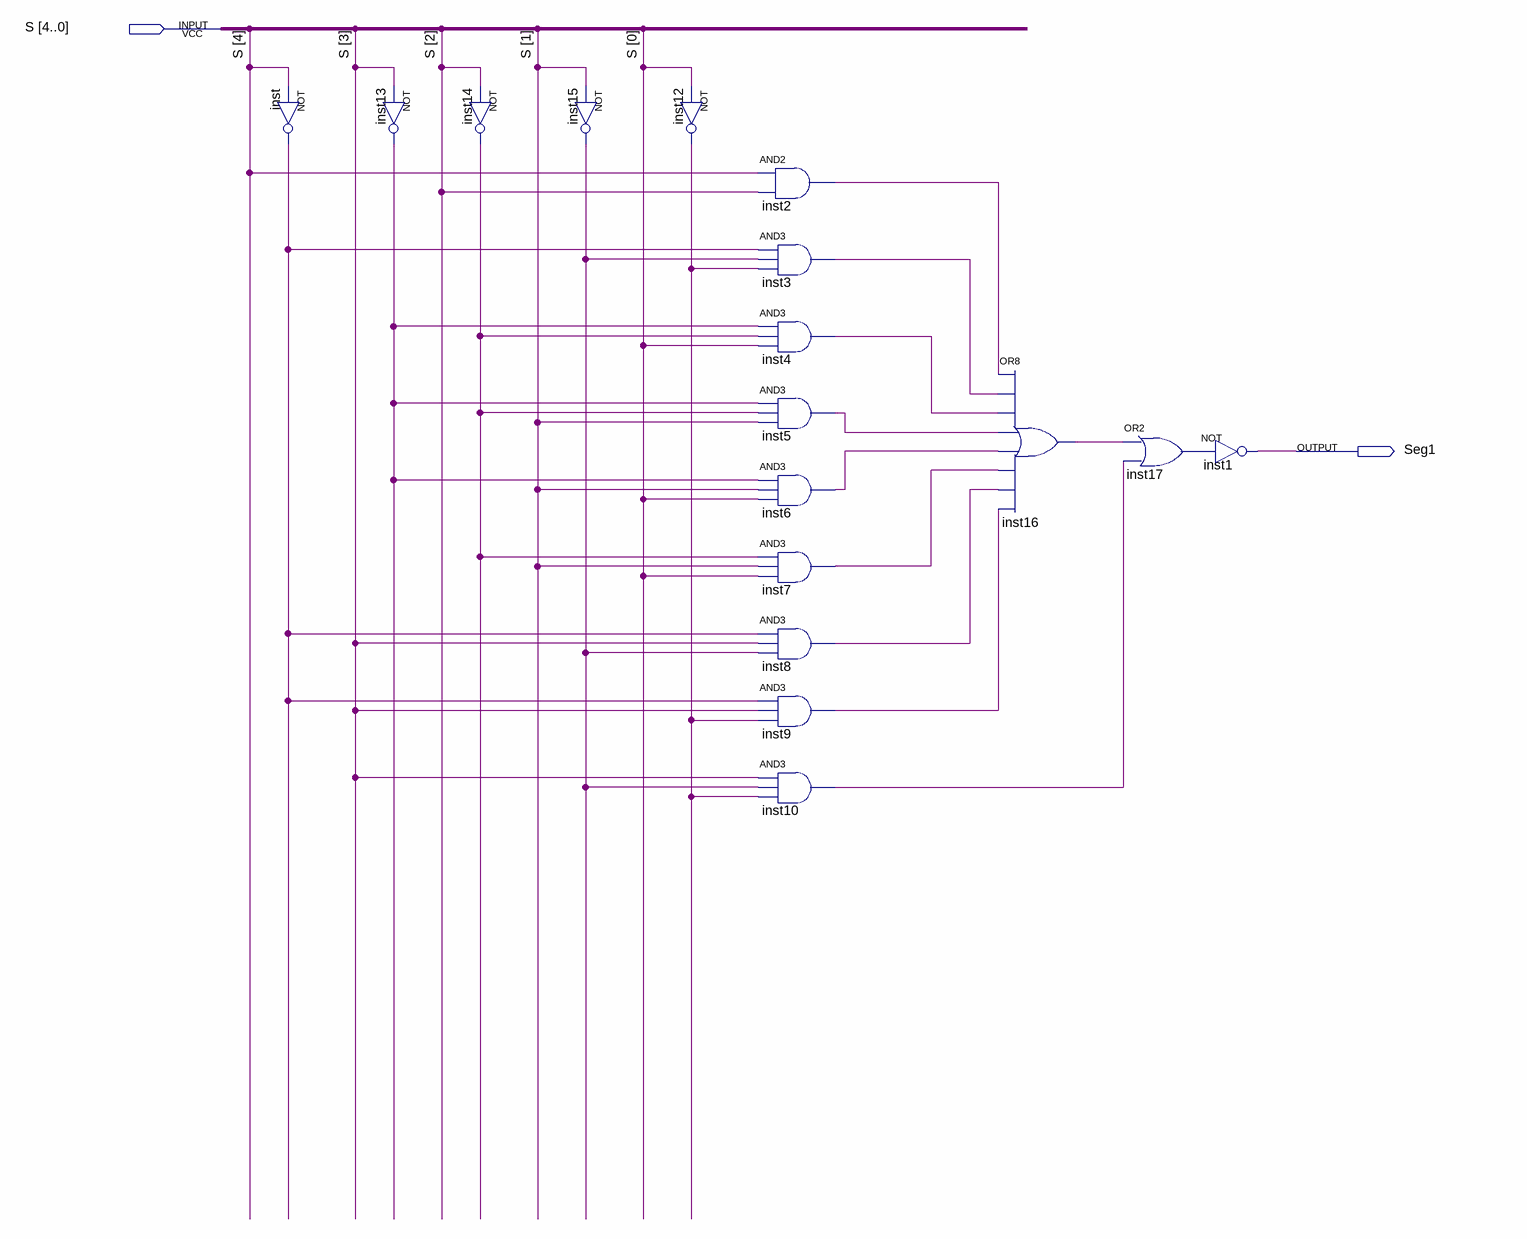
[diagram p0: schematic sheet]
// Quartus schematic Seg1.bdf as structural Verilog: 17 symbols, 2 pins
module Seg1 (
  input  [4:0] S,
  output Seg1
);

  wire inst2_out, inst3_out, inst4_out, inst5_out, inst6_out, inst7_out, inst8_out, inst9_out, inst10_out,
       inst12_out, inst13_out, inst14_out, inst15_out, inst16_out, inst17_out, inst_out;

  not inst (inst_out, S[4]);
  not inst13 (inst13_out, S[3]);
  not inst14 (inst14_out, S[2]);
  not inst15 (inst15_out, S[1]);
  not inst12 (inst12_out, S[0]);
  and inst2 (inst2_out, S[4], S[2]);
  and inst3 (inst3_out, inst_out, inst15_out, inst12_out);
  and inst4 (inst4_out, inst13_out, inst14_out, S[0]);
  and inst5 (inst5_out, inst13_out, inst14_out, S[1]);
  and inst6 (inst6_out, inst13_out, S[1], S[0]);
  and inst7 (inst7_out, inst14_out, S[1], S[0]);
  and inst8 (inst8_out, inst_out, S[3], inst15_out);
  and inst9 (inst9_out, inst_out, S[3], inst12_out);
  and inst10 (inst10_out, S[3], inst15_out, inst12_out);
  or inst16 (inst16_out, inst2_out, inst3_out, inst4_out, inst5_out, inst6_out, inst7_out, inst8_out, inst9_out);
  or inst17 (inst17_out, inst16_out, inst10_out);
  not inst1 (Seg1, inst17_out);
endmodule
